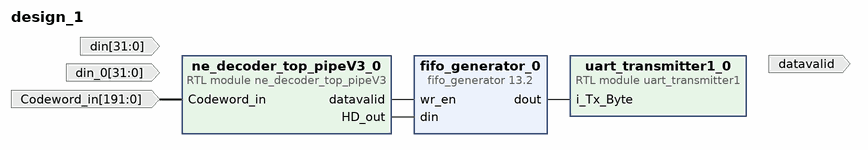
[diagram p0: block diagram of the top level]
# Vivado block design design_1, xcvu9p-flga2104-2L-e, Vivado 2019.1
create_bd_design design_1

create_bd_port -dir I -from 191 -to 0 Codeword_in
create_bd_port -dir O datavalid
create_bd_port -dir I -from 31 -to 0 din
create_bd_port -dir I -from 31 -to 0 din_0

create_bd_cell -type module -reference ne_decoder_top_pipeV3 ne_decoder_top_pipeV3_0
create_bd_cell -type ip -vlnv xilinx.com:ip:fifo_generator:13.2 fifo_generator_0
set_property -dict [list \
  CONFIG.Input_Data_Width 32 \
  CONFIG.Output_Data_Width 8 \
  CONFIG.asymmetric_port_width true \
] [get_bd_cells fifo_generator_0]
create_bd_cell -type module -reference uart_transmitter1 uart_transmitter1_0

# ---- connections ----

connect_bd_net [get_bd_ports Codeword_in] [get_bd_pins ne_decoder_top_pipeV3_0/Codeword_in]
connect_bd_net [get_bd_pins ne_decoder_top_pipeV3_0/datavalid] [get_bd_pins fifo_generator_0/wr_en]
connect_bd_net [get_bd_pins ne_decoder_top_pipeV3_0/HD_out] [get_bd_pins fifo_generator_0/din]
connect_bd_net [get_bd_pins fifo_generator_0/dout] [get_bd_pins uart_transmitter1_0/i_Tx_Byte]

validate_bd_design
save_bd_design
